# EAGLE design Mercator FeatherWing RevA (EAGLE 9.6.2)
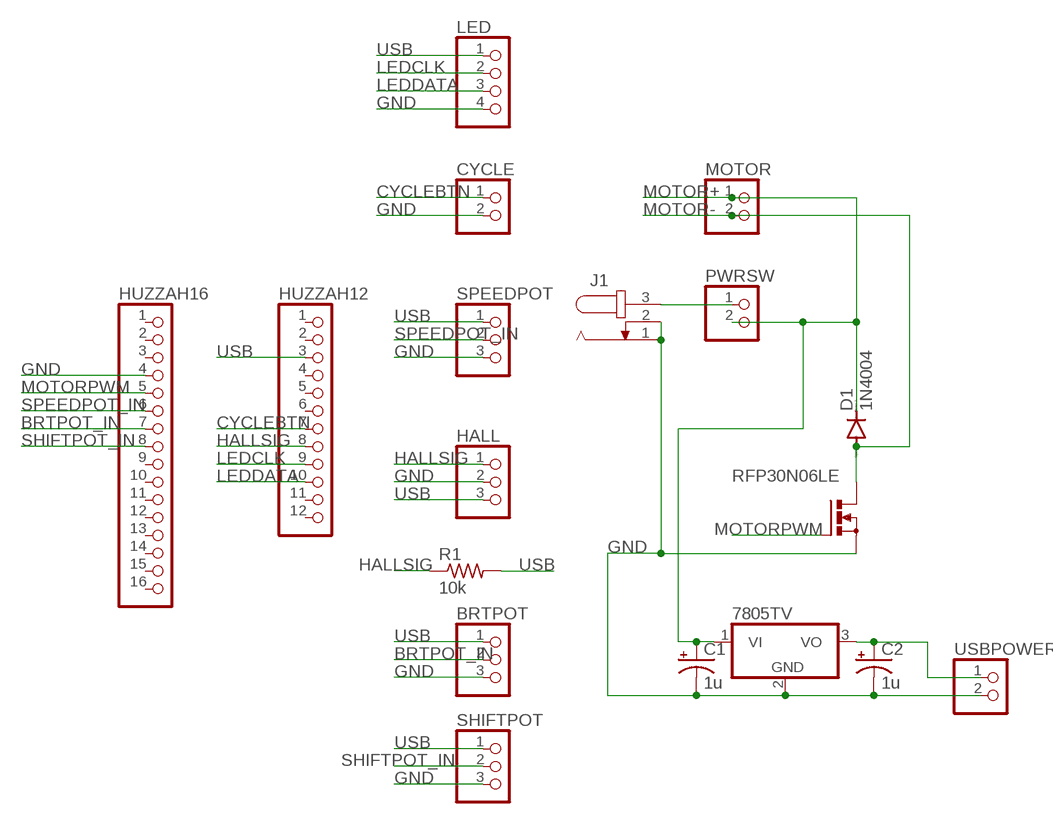
[diagram p0: schematic, sheet 1]

## Parts
7805ABV  7805TV  [TO220V]
BRTPOT  PINHD-1X3  [1X03]
C1  1u  CPOL-USE2-5  [E2-5]
C2  1u  CPOL-USE2-5  [E2-5]
CYCLE  PINHD-1X2  [1X02]
D1  1N4004  [DO41-10]
HALL  PINHD-1X3  [1X03]
HUZZAH12  PINHD-1X12  [1X12]
HUZZAH16  PINHD-1X16  [1X16]
J1  JACK-PLUG0  [SPC4077]
LED  PINHD-1X4  [1X04]
MOTOR  PINHD-1X2  [1X02]
PWRSW  PINHD-1X2  [1X02]
R1  10k  R-US_0207/10  [0207/10]
RFP30N06LE  PMOSFET_NTO220BV  [TO220BV]
SHIFTPOT  PINHD-1X3  [1X03]
SPEEDPOT  PINHD-1X3  [1X03]
USBPOWER  PINHD-1X2  [1X02]

## Nets
BRTPOT_IN: BRTPOT.2 HUZZAH16.7
CYCLEBTN: CYCLE.1 HUZZAH12.7
GND [power]: 7805ABV.2(GND) BRTPOT.3 C1.- C2.- CYCLE.2 HALL.2 HUZZAH16.4 J1.1 J1.2 LED.4 RFP30N06LE.S SHIFTPOT.3 SPEEDPOT.3 USBPOWER.2
HALLSIG: HALL.1 HUZZAH12.8 R1.1
LEDCLK: HUZZAH12.9 LED.2
LEDDATA: HUZZAH12.10 LED.3
MOTOR+ [power]: 7805ABV.1(VI) C1.+ D1.C MOTOR.1 PWRSW.2
MOTOR- [power]: D1.A MOTOR.2 RFP30N06LE.D
MOTORPWM: HUZZAH16.5 RFP30N06LE.G
N$2 [power]: J1.3 PWRSW.1
SHIFTPOT_IN: HUZZAH16.8 SHIFTPOT.2
SPEEDPOT_IN: HUZZAH16.6 SPEEDPOT.2
USB [power]: BRTPOT.1 HALL.3 HUZZAH12.3 LED.1 R1.2 SHIFTPOT.1 SPEEDPOT.1
USB+ [power]: 7805ABV.3(VO) C2.+ USBPOWER.1
Unconnected: HUZZAH12.1 HUZZAH12.2 HUZZAH12.4 HUZZAH12.5 HUZZAH12.6 HUZZAH12.11 HUZZAH12.12 HUZZAH16.1 HUZZAH16.2 HUZZAH16.3 HUZZAH16.9 HUZZAH16.10 HUZZAH16.11 HUZZAH16.12 HUZZAH16.13 HUZZAH16.14 HUZZAH16.15 HUZZAH16.16

## Library data of the parts
7805ABV = linear:78*: Positive VOLTAGE REGULATOR Source: http://cache.national.com/ds/LM/LM78L05.pdf http://www.fairchildsemi.com/ds/LM/LM7805.pdf
BRTPOT HALL SHIFTPOT SPEEDPOT = pinhead:PINHD-1X3: PIN HEADER
C1 C2 = rcl:CPOL-US: POLARIZED CAPACITOR, American symbol; SPICEPREFIX: C
CYCLE MOTOR PWRSW USBPOWER = pinhead:PINHD-1X2: PIN HEADER
D1 = diode:1N4004: DIODE general purpose rectifier, 1 A
HUZZAH12 = pinhead:PINHD-1X12: PIN HEADER
HUZZAH16 = pinhead:PINHD-1X16: PIN HEADER
J1 = con-jack:JACK-PLUG: DC POWER JACK Power Jack, DC, Right Angle, Through Hole, Rated 5A at 16VDC, PC Terminals Distributor: Farnell (www.Farnell.de) Drawing: 84N1161.pdf / 84N1162.pdf Manufacturer: SPC Technology (www.spctechnology.com) Type: SPC4077 / SPC 4078; OC_FARNELL: unknown; OC_NEWARK: unknown
LED = pinhead:PINHD-1X4: PIN HEADER
R1 = rcl:R-US_: RESISTOR, American symbol; SPICEPREFIX: R
RFP30N06LE = transistor-power:PMOSFET_N: Power MOSFET N-Channel

## Net classes
1 power: width 1.016 mm

## Board
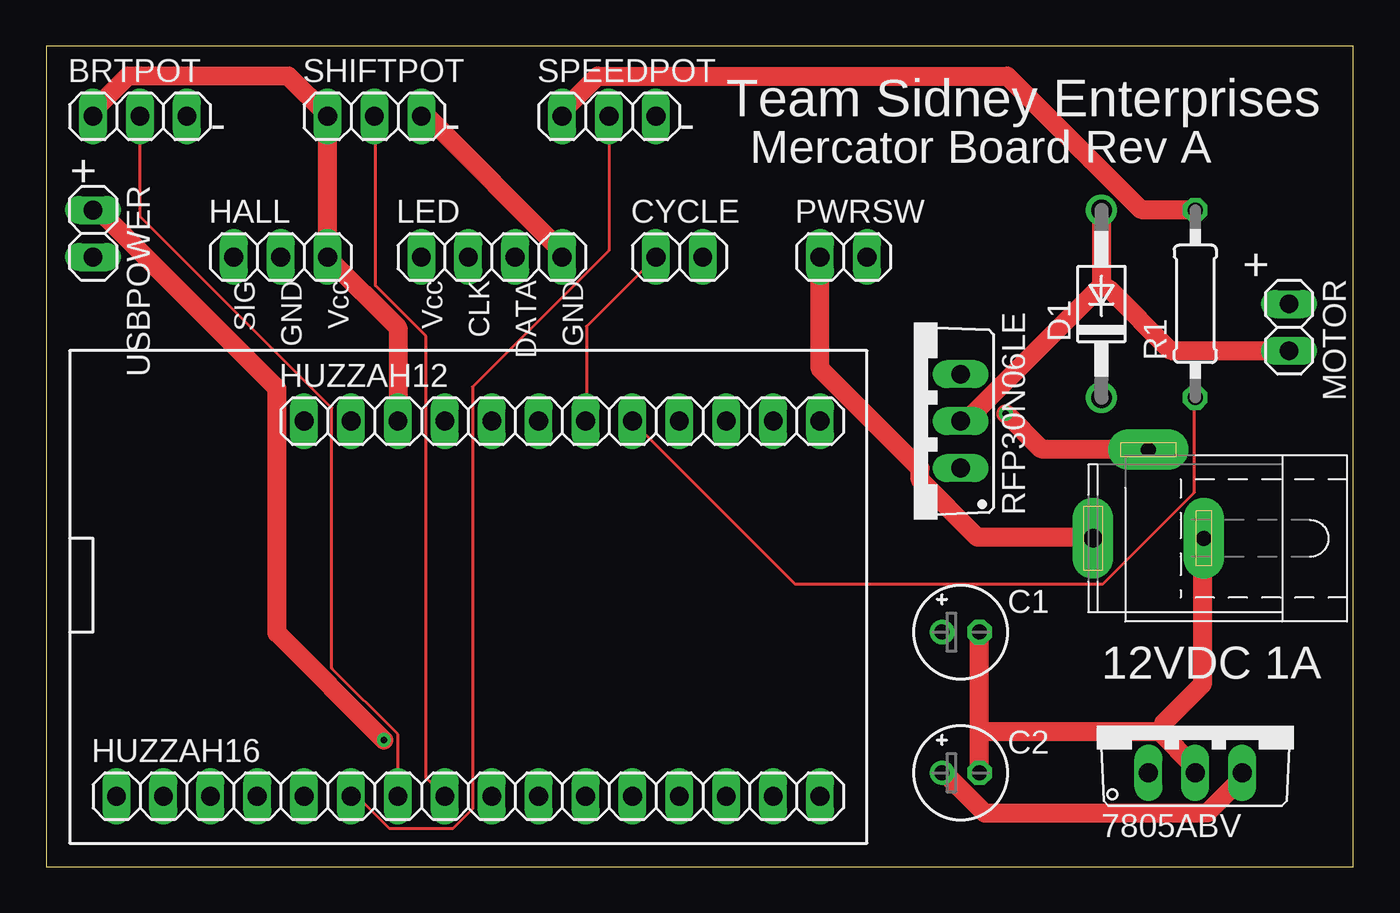
[diagram p1: board, top side]
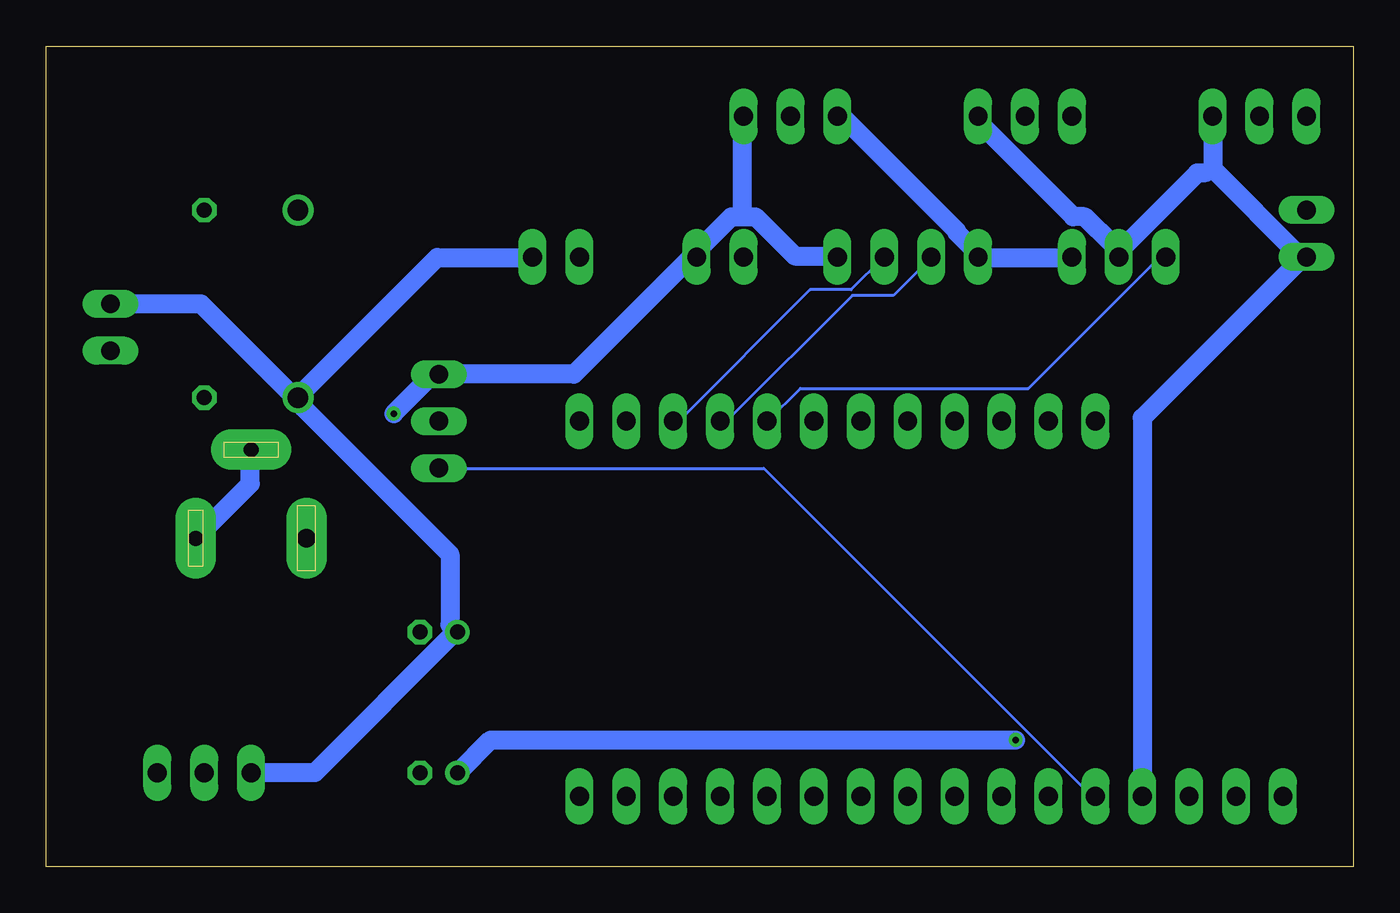
[diagram p2: board, bottom side, seen from below]

Size 70.79 x 44.44 mm. Coordinates in mm from the lower left corner, seen from the top.
Outline: 0,0 70.79,0 70.79,44.44 0,44.44 0,0
Copper layers (1*16): Top 0.035mm / dielectric 1.5mm / Bottom 0.035mm
Design rules "default": minimum track width 6mil, minimum drill 0.35mm, track to track 6mil, track to pad 6mil, pad to pad 6mil, via to via 6mil, smd to smd 6mil, copper to edge 40mil, drill to drill 6mil, minimum pad ring 10mil, minimum via ring 8mil, stop-mask expansion 4mil, vias tented up to drill 0mil, thermal gap 10mil

### Footprints (pad centres in the part's own frame; a part is rotated, then mirrored left to right if it is on the bottom)
TO220V = drill 1.016 long: 1 -2.54,-2.54; 2 0,-2.54; 3 2.54,-2.54
1X03 = drill 1.016 long: 1 -2.54,0; 2 0,0; 3 2.54,0
E2-5 = drill 0.813 pad 1.27: + -1.016,0 | drill 0.813 pad 1.27 octagon: - 1.016,0
1X02 = drill 1.016 long: 1 -1.27,0; 2 1.27,0
DO41-10 = drill 1.118: A 5.08,0; C -5.08,0
1X12 = drill 1.016 long: 1 -13.97,0; 2 -11.43,0; 3 -8.89,0; 4 -6.35,0; 5 -3.81,0; 6 -1.27,0; 7 1.27,0; 8 3.81,0; 9 6.35,0; 10 8.89,0; 11 11.43,0; 12 13.97,0
1X16 = drill 1.016 long: 1 -19.05,0; 2 -16.51,0; 3 -13.97,0; 4 -11.43,0; 5 -8.89,0; 6 -6.35,0; 7 -3.81,0; 8 -1.27,0; 9 1.27,0; 10 3.81,0; 11 6.35,0; 12 8.89,0; 13 11.43,0; 14 13.97,0; 15 16.51,0; 16 19.05,0
SPC4077 = drill 0.8 pad 2.184 long: 1 -3,0; 2 0,-4.8 | drill 1 pad 2.184 long: 3 3,0
1X04 = drill 1.016 long: 1 -3.81,0; 2 -1.27,0; 3 1.27,0; 4 3.81,0
0207/10 = drill 0.813 octagon: 1 -5.08,0; 2 5.08,0
TO220BV = drill 1.016 long: D 0,-2.54; G -2.54,-2.54; S 2.54,-2.54

### Placement (x,y rotation side)
7805ABV  62.23,7.62 0 top
BRTPOT  5.08,40.64 0 top
C1  49.53,12.7 0 top
C2  49.53,5.08 0 top
CYCLE  34.29,33.02 0 top
D1  57.15,30.48 90 top
HALL  12.7,33.02 0 top
HUZZAH12  27.94,24.13 0 top
HUZZAH16  22.86,3.81 0 top
J1  59.69,17.78 180 top
LED  24.13,33.02 0 top
MOTOR  67.31,29.21 270 top
PWRSW  43.18,33.02 0 top
R1  62.23,30.48 90 top
RFP30N06LE  46.99,24.13 90 top
SHIFTPOT  17.78,40.64 0 top
SPEEDPOT  30.48,40.64 0 top
USBPOWER  2.54,34.29 270 top

### Tracks (layer width: path | path; a pad name or v marks a point on that pad's centre or on a via)
BRTPOT_IN
  Top 0.152: HUZZAH16.7 19.05,7.16 15.47,10.74 15.47,24.84 5.11,35.2 5.11,40.62 BRTPOT.2
CYCLEBTN
  Top 0.152: CYCLE.1 29.26,29.26 29.26,24.16 HUZZAH12.7
GND  (via drill 0.35)
  Top 1.016: 50.52,7.32 50.52,12.65 C1.- | 50.52,7.32 50.52,5.11 C2.- | 60.27,7.32 62.18,5.41 62.18,5.11 7805ABV.2 | 50.52,7.32 60.27,7.32 | J1.1 62.64,17.75 62.64,9.91 60.5,7.77 60.27,7.32 | v51.97,24.54 53.87,22.63 59.66,22.63 J1.2 | SHIFTPOT.3 20.34,40.62 20.65,40.62 27.89,33.38 27.89,33.07 LED.4
  Bottom 1.016: 7.62,37.8 2.9,33.07 2.59,33.07 USBPOWER.2 3.12,32.61 11.43,24.31 HUZZAH16.4 | BRTPOT.3 7.62,37.8 | 7.62,37.8 8.08,37.57 8.46,37.57 12.65,33.38 12.65,33.07 HALL.2 13.03,33.68 14.55,35.2 15.16,35.2 20.27,40.31 20.27,40.62 SHIFTPOT.3 | J1.2 59.74,22.55 59.74,20.73 62.64,17.83 J1.1 | 33.07,35.2 33.68,35.2 35.51,33.38 35.51,33.07 CYCLE.2 36.04,32.84 42.22,26.67 RFP30N06LE.S 49.99,26.52 v51.97,24.54 | 33.07,35.2 32.38,35.2 30.25,33.07 27.96,33.07 LED.4 | 33.07,35.2 33.07,40.62 SPEEDPOT.3
HALLSIG
  Top 0.152: R1.1 62.18,25.38 62.18,20.27 57.23,15.32 40.54,15.32 31.77,24.08 HUZZAH12.8
  Bottom 0.152: HALL.1 10.21,32.99 10.52,32.99 17.6,25.91 29.95,25.91 31.7,24.16 HUZZAH12.8
LEDCLK
  Bottom 0.152: HUZZAH12.9 34.29,24.16 33.91,24.16 27.13,30.94 24.92,30.94 22.86,32.99 LED.2
LEDDATA
  Bottom 0.152: HUZZAH12.10 36.8,24.16 36.5,24.16 29.41,31.24 27.2,31.24 25.45,32.99 LED.3
MOTOR+
  Bottom 1.016: 7805ABV.1 59.66,5.11 56.24,5.11 48.69,12.65 48.54,12.65 C1.+ 48.92,13.11 48.92,16.92 56.92,24.92 D1.C | PWRSW.2 44.5,32.99 49.61,32.99 57.15,25.45 D1.C | MOTOR.1 62.41,30.48 57.61,25.68 D1.C
MOTOR-
  Top 1.016: 57.15,31.47 49.84,24.16 49.53,24.16 RFP30N06LE.D | D1.A 57.15,31.47 | MOTOR.2 67.28,27.96 60.88,27.96 57.61,31.24 57.15,31.47
MOTORPWM
  Bottom 0.152: HUZZAH16.5 14.17,3.81 31.93,21.57 49.53,21.57 RFP30N06LE.G
N$2
  Top 1.016: PWRSW.1 41.91,26.98 47.32,21.57 47.32,20.95 50.44,17.83 56.62,17.83 J1.3
SHIFTPOT_IN
  Top 0.152: SHIFTPOT.2 17.83,40.62 17.83,31.47 20.57,28.73 20.57,4.8 21.57,3.81 HUZZAH16.8
SPEEDPOT_IN
  Top 0.152: HUZZAH16.6 16.84,3.81 18.59,2.06 22.02,2.06 23.09,3.12 23.09,25.98 30.48,33.38 SPEEDPOT.2
USB
  Top 1.016: BRTPOT.1 2.59,40.69 2.59,41 4.42,42.82 13.11,42.82 15.24,40.69 SHIFTPOT.1 HALL.3 15.24,32.99 19.05,29.18 HUZZAH12.3 | R1.2 62.18,35.59 59.28,35.59 52.05,42.82 29.87,42.82 27.96,40.92 27.96,40.69 SPEEDPOT.1
  Bottom 1.016: HALL.3 15.24,32.99 20.27,32.99 LED.1 20.57,33.45 21.49,34.37 21.49,34.44 27.66,40.62 27.89,40.62 SPEEDPOT.1
USB+  (via drill 0.35)
  Top 1.016: 7805ABV.3 64.77,4.8 62.87,2.9 50.83,2.9 48.69,5.03 48.54,5.03 C2.+ | v18.29,6.86 12.5,12.65 12.5,25.91 2.9,35.51 2.59,35.51 USBPOWER.1
  Bottom 1.016: v18.29,6.86 46.71,6.86 48.46,5.11 C2.+

### Text on the board
tNames: Team Sidney Enterprises | - | - | - | Mercator Board Rev A | + | SIG | GND | Vcc | Vcc | CLK | DATA | GND | + | 12VDC 1A